# Altium schematic sheet IVSense.SchDoc: Gemini++
size Letter; Author: Ye-Sheng Kuo; Revision: 7; SheetTotal: 4
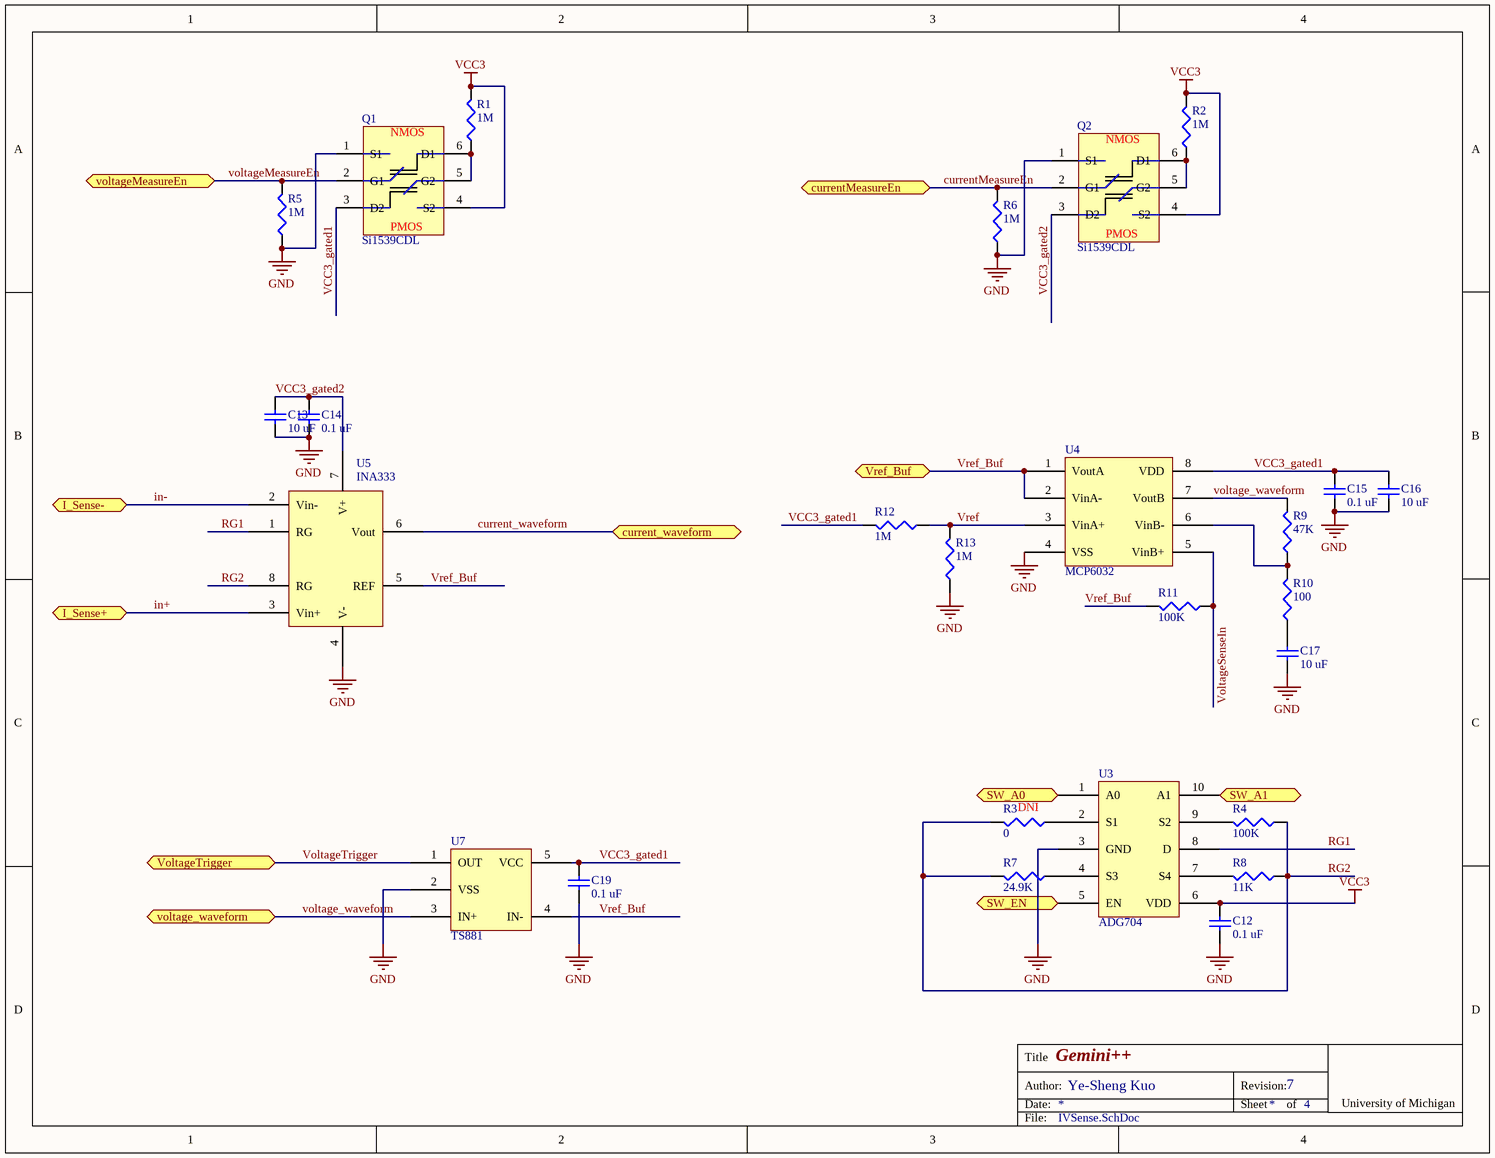
[diagram p0: IVSense.SchDoc]

## Parts
C12  value 0.1 uF  [0402]  (hidden comment: Ceramic capacitor)
C13  value 10 uF  [0603]  (hidden comment: Ceramic capacitor)
C14  value 0.1 uF  [0402]  (hidden comment: Ceramic capacitor)
C15  value 0.1 uF  [0402]  (hidden comment: Ceramic capacitor)
C16  value 10 uF  [0603]  (hidden comment: Ceramic capacitor)
C17  value 10 uF  [0603]  (hidden comment: Ceramic capacitor)
C19  value 0.1 uF  [0402]  (hidden comment: Ceramic capacitor)
Q1  Si1539CDL  [SC70-6]
Q2  Si1539CDL  [SC70-6]
R1  value 1M  [0402]  (hidden comment: Chip resistor)
R2  value 1M  [0402]  (hidden comment: Chip resistor)
R3  value 0  [0402]  (hidden comment: Chip resistor)
R4  value 100K  [0402]  (hidden comment: Chip resistor)
R5  value 1M  [0402]  (hidden comment: Chip resistor)
R6  value 1M  [0402]  (hidden comment: Chip resistor)
R7  value 24.9K  [0402]  (hidden comment: Chip resistor)
R8  value 11K  [0402]  (hidden comment: Chip resistor)
R9  value 47K  [0402]  (hidden comment: Chip resistor)
R10  value 100  [0402]  (hidden comment: Chip resistor)
R11  value 100K  [0402]  (hidden comment: Chip resistor)
R12  value 1M  [0402]  (hidden comment: Chip resistor)
R13  value 1M  [0402]  (hidden comment: Chip resistor)
U3  ADG704  [uSOIC-10]
U4  MCP6032  [MSOP-8]
U5  INA333  [MSOP-8]
U7  TS881  [SC70-5]

## Ports
current_waveform, currentMeasureEn, I_Sense+, I_Sense-, SW_A0, SW_A1, SW_EN, voltage_waveform, voltageMeasureEn, VoltageTrigger, Vref_Buf

## Nets
GND: C12.2 C13.2 C14.2 C15.2 C16.2 C17.2 C19.2 Q1.1(S1) Q2.1(S1) R5.2 R6.2 R13.2 U3.3(GND) U4.4(VSS) U5.4(V-) U7.2(VSS)
VCC3: C12.1 Q1.4(S2) Q2.4(S2) R1.1 R2.1 U3.6(VDD)
current_waveform: U5.6(Vout) ; port current_waveform
currentMeasureEn: Q2.2(G1) R6.1 ; port currentMeasureEn
in+: U5.3(Vin+) ; port I_Sense+
in-: U5.2(Vin-) ; port I_Sense-
RG1: U3.8(D) U5.1(RG)
RG2: R3.1 R4.2 R7.1 R8.2 U5.8(RG)
SW_A0: U3.1(A0) ; port SW_A0
SW_A1: U3.10(A1) ; port SW_A1
SW_EN: U3.5(EN) ; port SW_EN
VCC3_gated1: C15.1 C16.1 C19.1 Q1.3(D2) R12.1 U4.8(VDD) U7.5(VCC)
VCC3_gated2: C13.1 C14.1 Q2.3(D2) U5.7(V+)
voltage_waveform: R9.1 U4.7(VoutB) U7.3(IN+) ; port voltage_waveform
voltageMeasureEn: Q1.2(G1) R5.1 ; port voltageMeasureEn
VoltageSenseIn: R11.2 U4.5(VinB+)
VoltageTrigger: U7.1(OUT) ; port VoltageTrigger
Vref: R12.2 R13.1 U4.3(VinA+)
Vref_Buf: R11.1 U4.1(VoutA) U4.2(VinA-) U5.5(REF) U7.4(IN-) ; port Vref_Buf
NetC17_1: C17.1 R10.2
NetQ1_5: Q1.5(G2) Q1.6(D1) R1.2
NetQ2_5: Q2.5(G2) Q2.6(D1) R2.2
NetR3_2: R3.2 U3.2(S1)
NetR4_1: R4.1 U3.9(S2)
NetR7_2: R7.2 U3.4(S3)
NetR8_1: R8.1 U3.7(S4)
NetR9_2: R9.2 R10.1 U4.6(VinB-)

## Notes on the sheet
- (near R3) DNI
- Title
- Date:
- Author:
- Revision:
- Sheet
- of
- University of Michigan
- File:
- (in symbol Si1539CDL) NMOS; PMOS

## Library data of the parts
C12 C14 C15 C19 = C_0.1u_10V_0402_ceramic: Ceramic capacitor, 0.1u, 0402 package; Manufacture: TDK; voltage rated: 10 V; tolerance: 10%; Supplier 1: Digi-Key; Supplier Part Number 1: 445-1265-1-ND; package: 0402
C13 C16 C17 = C_10u_6.3V_0603_ceramic: Ceramic capacitor, 10 uF, 0603 package; Manufacture: TDK; voltage rated: 6.3V; tolerance: 20%; package: 0603; Supplier 1: Digi-Key; Supplier Part Number 1: 445-4112-1-ND
Q1 Q2 = Si1539CDL: N- and P-Channel 30 V (D-S) MOSFET; Supplier 1: Digi-Key; Supplier Part Number 1: SI1539CDL-T1-GE3CT-ND
R1 R2 R5 R6 R12 R13 = R_1M_0402: Chip resistor, 1M, 0402 package; tolerance: 1%; power: 1/16 W; Supplier 1: Digi-Key; Supplier Part Number 1: 541-1.00MLCT-ND; package: 0402
R3 = R_0_0402: Chip resistor, 0, 0402 package; package: 0402; Supplier 1: Digi-Key; Supplier Part Number 1: 541-0.0YBCT-ND
R4 R11 = R_100K_0402: Chip resistor, 100K, 0402 package; tolerance: 1%; power: 1/16 W; Supplier 1: Digi-Key; Supplier Part Number 1: 541-100KLCT-ND; package: 0402
R7 = R_24.9K_0402: Chip resistor, 24.9K, 0402 package; tolerance: 1%; power: 1/16 W; package: 0402; Supplier 1: Digi-Key; Supplier Part Number 1: 541-24.9KLCT-ND
R8 = R_11K_0402: Chip resistor, 11K, 0603 package; tolerance: 1%; power: 1/16 W; package: 0402; Supplier 1: Digi-Key; Supplier Part Number 1: 541-11.0KLCT-ND
R9 = R_47K_0402: Chip resistor, 47K, 0402 package; tolerance: 1%; power: 1/16 W; package: 0402; Supplier 1: Digi-Key; Supplier Part Number 1: 541-47.0KLCT-ND
R10 = R_100_0402: Chip resistor, 100, 0402 package; tolerance: 1%; power: 1/16 W; package: 0402; Supplier 1: Digi-Key; Supplier Part Number 1: 541-100LCT-ND
U3 = ADG704: CMOS  Low Voltage 4 V, 4-Channel Multiplexer; Supplier 1: Digi-Key; Supplier Part Number 1: ADG704BRMZ-REELCT-ND
U4 = MCP6032: 0.9 µA, High Precision Op Amps; Supplier 1: Digi-Key; Supplier Part Number 1: MCP6032T-E/MSCT-ND
U5 = INA333: Micro-Power (50µA), Zerø-Drift, Rail-to-Rail Out  Instrumentation Amplifier; Supplier 1: Digi-Key; Supplier Part Number 1: 296-23564-1-ND
U7 = TS881: Rail-to-rail 0.9 V nanopower comparator; Supplier 1: Digi-Key; Supplier Part Number 1: 497-13217-1-ND